# Altium project ARMBAND2_0.PrjPcb
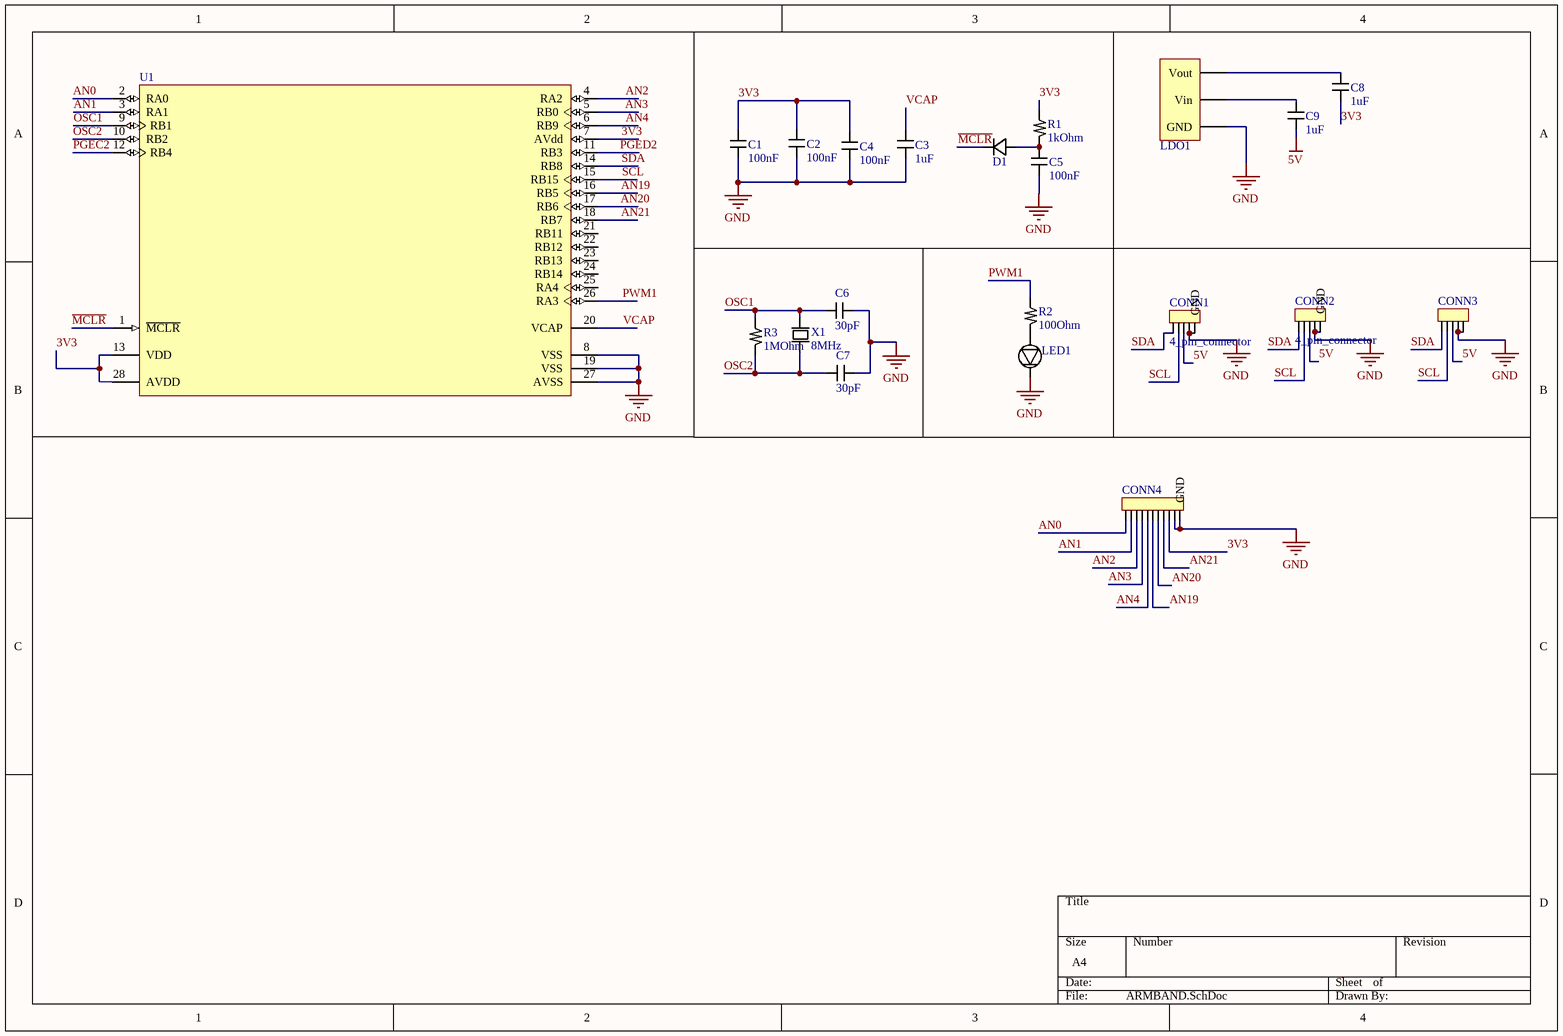
[diagram p0: ARMBAND.SchDoc]
1 sheet, 21 parts. Net scope: global (net labels, ports and power ports of the same name join across sheets).
Board file: ARMBAND.PcbDoc

## Sheet ARMBAND.SchDoc
size A4

### Parts
C1  100nF  [CApacitor_1608]
C2  100nF  [CApacitor_1608]
C3  1uF  [Capacitor_20x12]
C4  100nF  [CApacitor_1608]
C5  100nF  [CApacitor_1608]
C6  30pF  [CApacitor_1608]
C7  30pF  [CApacitor_1608]
C8  1uF  [Capacitor_20x12]
C9  1uF  [Capacitor_20x12]
CONN1  4_pin_connector  [4PIN_1MMPITCH_FFC_FCP_ZIF]
CONN2  4_pin_connector  [4PIN_1MMPITCH_FFC_FCP_ZIF]
CONN3  4_pin_connector  [4Pin_PICO_EZ_MATE_Header]  (value not drawn)
CONN4  10_pin_connector  [10Pin_1mmpitch_FFC_FCP_ZIF]  (value not drawn)
D1  Diode_SMD  [DIODE_17x38]  (value not drawn)
LDO1  Voltage Reg.  [LDO_460x260]  (value not drawn)
LED1  LED_SMD  [LED_1608]  (value not drawn)
R1  1kOhm  [Resistor_1608]
R2  100Ohm  [Resistor_1608]
R3  1MOhm  [Resistor_1608]
U1  DSPIC33EP128MC202-I/SO  [MCHP-SOIC-SO28_N]  (value not drawn)
X1  8MHz  [xTal_150x20]

### Nets
5V: C9.Cap_p1 CONN1.3 CONN2.3 CONN3.3
GND: C1.Cap_p2 C2.Cap_p2 C3.Cap_p2 C4.Cap_p2 C5.Cap_p2 C6.Cap_p1 C7.Cap_p1 CONN1.4 CONN1.GND CONN2.4 CONN2.GND CONN3.4 CONN3.GND CONN4.10 CONN4.GND LDO1.GND LED1.Cathode U1.8(VSS) U1.19(VSS) U1.27(AVSS)
3V3: C1.Cap_p1 C2.Cap_p1 C4.Cap_p1 C8.Cap_p1 CONN4.9 R1.Res_p1 U1.7(AVdd) U1.13(VDD) U1.28(AVDD)
~{MCLR}: D1.Cathode U1.1(~{MCLR})
AN0: CONN4.1 U1.2(RA0)
AN1: CONN4.2 U1.3(RA1)
AN2: CONN4.3 U1.4(RA2)
AN3: CONN4.4 U1.5(RB0)
AN4: CONN4.5 U1.6(RB9)
AN19: CONN4.6 U1.16(RB5)
AN20: CONN4.7 U1.17(RB6)
AN21: CONN4.8 U1.18(RB7)
OSC1: C6.Cap_p2 R3.Res_p1 U1.9(RB1) X1.xTal_0
OSC2: C7.Cap_p2 R3.Res_p2 U1.10(RB2) X1.xTal_1
PGEC2: U1.12(RB4)
PGED2: U1.11(RB3)
PWM1: R2.Res_p1 U1.26(RA3)
SCL: CONN1.2 CONN2.2 CONN3.2 U1.15(RB15)
SDA: CONN1.1 CONN2.1 CONN3.1 U1.14(RB8)
VCAP: C3.Cap_p1 U1.20(VCAP)
NetC5_Cap_p1: C5.Cap_p1 D1.Anode R1.Res_p2
NetC8_Cap_p2: C8.Cap_p2 LDO1.Vout
NetC9_Cap_p2: C9.Cap_p2 LDO1.Vin
NetLED1_Anode: LED1.Anode R2.Res_p2

Not connected (* = marked no-connect by the designer): U1 21(RB11) 22(RB12) 23(RB13) 24(RB14) 25(RA4)

### Library data of the parts
C1-C9 = Capacitor_SMD: SMD Capacitor
CONN1-CONN3 = 4_pin_connector: 4 Pin Connector
CONN4 = 10_pin_connector: 10 Pin Connector
D1 = Diode_SMD: SMD Diode
LDO1 = Voltage_Regulator_3.3V: LDO Voltage Regulator; Manifacturer: ST Microelectronics
LED1 = LED_SMD: SMD Blue LED
R1-R3 = Resistor_SMD: SMD Resistor; Manifacturer: Vishay
U1 = DSPIC33EP128MC202-I/SO: 16-Bit Microcontroller and Digital Signal Controller with High-Speed PWM, Op Amps and Advanced Analog, 70 MIPS, 21 I/O, GPIO, -40 to 85 degC, 28-pin SOIC (SO28), Tube; Manufacturer: Microchip; DatasheetVersion: Rev. F; PackageVersion: C04-052C; PackageReference: SOIC-SO28; PackageDescription: 28-Lead Plastic Small Outline, 17.9 x 7.5 mm Body, 1.27 mm Pitch; Supplier 1: Digi-Key; Supplier Part Number 1: DSPIC33EP128MC202-I/SO-ND; Supplier 2: Mouser; Supplier Part Number 2: 579-33EP128MC202ISO; Mounting Technology: Surface Mount; PartNumber: DSPIC33EP128MC202-I/SO; ComponentLink1Description: Manufacturer URL; ComponentLink1URL: http://www.microchip.com; ComponentLink2Description: Datasheet; ComponentLink2URL: http://ww1.microchip.com/downloads/en/DeviceDoc/70657F.pdf; ComponentLink3Description: Package Specification; ComponentLink3URL: http://www.microchip.com/stellent/groups/techpub_sg/documents/packagingspec/en012702.pdf; ComponentLink4Description: Product URL; ComponentLink4URL: http://www.microchip.com/dsPIC33EP128MC202
X1 = xTal_ECS_inc: 8MHz Crystal/Resonator; Manifacturer: ECS International; Frequency: 8MHz